# EAGLE schematic data_recorder (EAGLE 8.3.1)
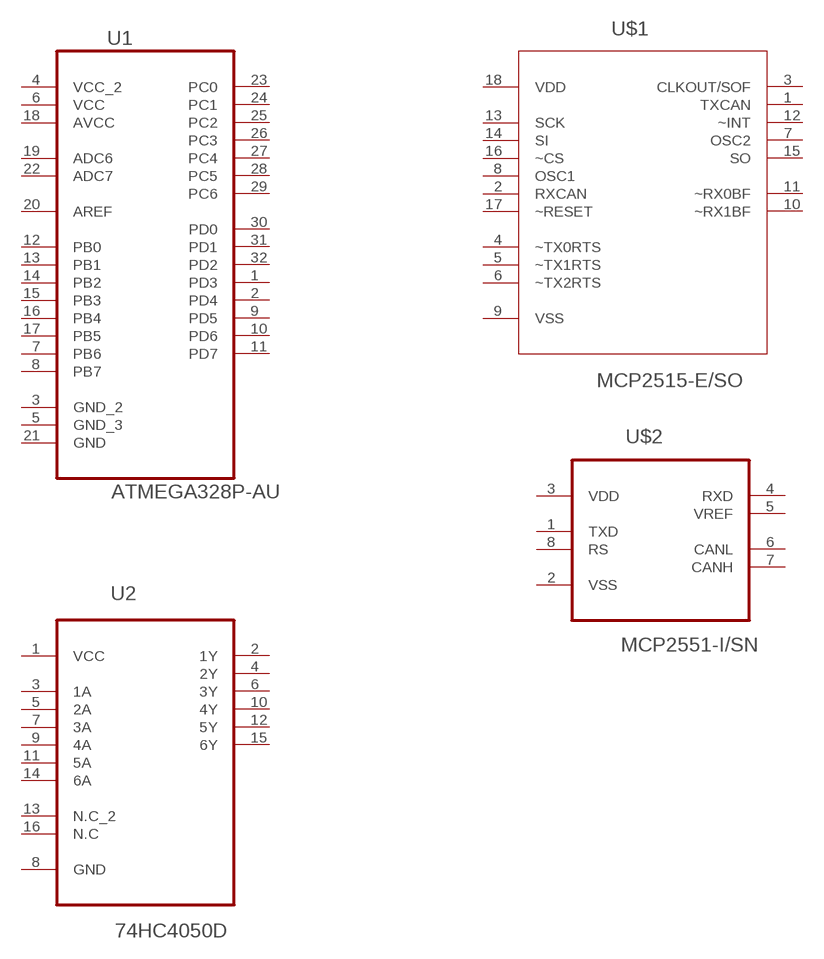
[diagram p0: schematic, sheet 1]

## Parts
U1  ATMEGA328P-AU  [QFP80P900X900X120-32N]
U2  74HC4050D  [SOIC127P600X175-16N]
U$1  MCP2515-E/SO  [SOIC127P1030X265-18N]
U$2  MCP2551-I/SN  [SOIC127P600X175-8N]
Unconnected: U1.1(PD3) U1.2(PD4) U1.3(GND_2) U1.5(GND_3) U1.7(PB6) U1.8(PB7) U1.9(PD5) U1.10(PD6) U1.11(PD7) U1.12(PB0) U1.13(PB1) U1.14(PB2) U1.15(PB3) U1.16(PB4) U1.17(PB5) U1.19(ADC6) U1.20(AREF) U1.21(GND) U1.22(ADC7) U1.23(PC0) U1.24(PC1) U1.25(PC2) U1.26(PC3) U1.27(PC4) U1.28(PC5) U1.29(PC6) U1.30(PD0) U1.31(PD1) U1.32(PD2) U2.2(1Y) U2.3(1A) U2.4(2Y) U2.5(2A) U2.6(3Y) U2.7(3A) U2.8(GND) U2.9(4A) U2.10(4Y) U2.11(5A) U2.12(5Y) U2.13(N.C_2) U2.14(6A) U2.15(6Y) U2.16(N.C) U$1.1(TXCAN) U$1.2(RXCAN) U$1.3(CLKOUT/SOF) U$1.4(~TX0RTS) U$1.5(~TX1RTS) U$1.6(~TX2RTS) U$1.7(OSC2) U$1.8(OSC1) U$1.10(~RX1BF) U$1.11(~RX0BF) U$1.12(~INT) U$1.13(SCK) U$1.14(SI) U$1.15(SO) U$1.16(~CS) U$1.17(~RESET) U$2.1(TXD) U$2.2(VSS) U$2.4(RXD) U$2.5(VREF) U$2.6(CANL) U$2.7(CANH) U$2.8(RS)

## Power pins joined to a net without a drawn wire
AVCC: U1.18(AVCC)
VCC: U1.6(VCC) U2.1(VCC)
VCC_2: U1.4(VCC_2)
VDD: U$1.18(VDD) U$2.3(VDD)
VSS: U$1.9(VSS)

## Library data of the parts
U1 = Atmel_By_element14_Batch_1-00:ATMEGA328P-AU: 8-bit Microcontroller with In-System Programmable Flash; MPN: ATMEGA328P-AU; OC_FARNELL: 1715486; OC_NEWARK: 14R4631; PACKAGE: TQFP-32; SUPPLIER: Atmel
U2 = NXP_By_element14_Batch_1:74HC4050D: Hex high-to-low level shifter; MPN: 74HC4050D; OC_FARNELL: 1085272; OC_NEWARK: -; PACKAGE: SOIC-16; SUPPLIER: NXP
U$1 = Microchip_By_element14_Batch_1:MCP2515-E/SO: Stand-Alone CAN Controller; DESCRIPTION: IC CAN CONTROLLER; MPN: MCP2515-E/SO; OC_FARNELL: 1605565; OC_NEWARK: 29H7134; PACKAGE: SOIC-18; SUPPLIER: Microchip
U$2 = Microchip_By_element14_Batch_1:MCP2551-I/SN: High-Speed CAN Transceiver; MPN: MCP2551-I/SN; OC_FARNELL: 9758569; OC_NEWARK: 69K7604; PACKAGE: SOIC-8; SUPPLIER: Microchip